# Altium schematic sheet [002] Battery.SchDoc
size A4
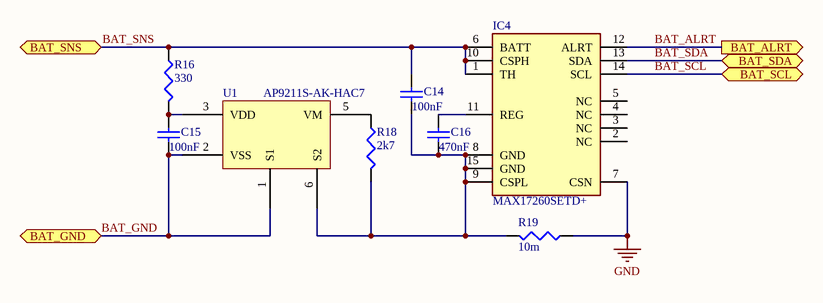
[diagram p0: [002] Battery.SchDoc]

## Parts
C14  value 100nF  [1608[0603]]  (hidden comment: Cap Semi)
C15  value 100nF  [1608[0603]]  (hidden comment: Cap Semi)
C16  value 470nF  [1608[0603]]  (hidden comment: Cap Semi)
IC4  MAX17260SETD+  [SON40P300X300X80-15N]
R16  value 330  [J1-0603]  (hidden comment: Res3)
R18  value 2k7  [J1-0603]  (hidden comment: Res3)
R19  value 10m  [RESC3216X80N]  (hidden comment: Res3)
U1  AP9211S-AK-HAC7  [U-DFN2030-6]

## Ports
BAT_ALRT (out), BAT_GND (bidir), BAT_SCL (bidir), BAT_SDA (bidir), BAT_SNS (bidir)

## Nets
GND: IC4.7(CSN) R19.1
BAT_ALRT: IC4.12(ALRT) ; port BAT_ALRT
BAT_GND: C15.1 U1.1(S1) U1.2(VSS) ; port BAT_GND
BAT_SCL: IC4.14(SCL) ; port BAT_SCL
BAT_SDA: IC4.13(SDA) ; port BAT_SDA
BAT_SNS: C14.2 IC4.1(TH) IC4.6(BATT) IC4.10(CSPH) R16.1 ; port BAT_SNS
NetC14_1: C14.1 C16.1 IC4.8(GND) IC4.9(CSPL) IC4.15(GND) R18.2 R19.2 U1.6(S2)
NetC15_2: C15.2 R16.2 U1.3(VDD)
NetC16_2: C16.2 IC4.11(REG)
NetR18_1: R18.1 U1.5(VM)

Not connected (* = marked no-connect by the designer): IC4 2(NC) 3(NC) 4(NC) 5(NC)

## Library data of the parts
C14-C16 = Cap Semi: Capacitor (Semiconductor SIM Model); Published: 8-Jun-2000; LatestRevisionDate: 29-May-2009; LatestRevisionNote: IPC-7351 Footprint Added.; PackageReference: C1206; Publisher: Altium Limited; PackageDescription: Chip Capacitor
IC4 = MAX17260SETD+: Integrated Circuit; Manufacturer_Name: Maxim Integrated; Datasheet Link: https://componentsearchengine.com/Datasheets/1/MAX17260SETD+.pdf; Height: 0.8mm; Mouser2 Part Number: 700-MAX17260SETD+; Mouser2 Price/Stock: https://www.mouser.com/Search/Refine.aspx?Keyword=700-MAX17260SETD%2B; Manufacturer_Part_Number: MAX17260SETD+; ComponentLink1Description: MAX17260 Datasheet; ComponentLink1URL: https://datasheets.maximintegrated.com/en/ds/MAX17260.pdf; ComponentLink2Description: MAX17260SETD+ (Mouser); ComponentLink2URL: https://pl.mouser.com/ProductDetail/Maxim-Integrated/MAX17260SETD%2b?qs=sGAEpiMZZMve4%2FbfQkoj%252BAnnYqGcWj2a8PZHpMVmFSA%3D; ComponentLink3Description: MAX17260 User Guide; ComponentLink3URL: https://pdfserv.maximintegrated.com/en/an/MAX1726x-ModelGauge-m5-EZ-user-guide.pdf
R16 R18 R19 = Res3: Resistor; Published: 8-Jun-2000; LatestRevisionDate: 29-May-2009; LatestRevisionNote: IPC-7351 Footprint Added.; PackageReference: J1-0603; Publisher: Altium Limited; PackageDescription: Chip Resistor
U1 = AP9211: SINGLE CHIP SOLUTION FOR 1-CELL Li+ BATTERY PACK; ComponentLink1Description: AP9211S-AK-HAC-7 (Mouser); ComponentLink1URL: https://pl.mouser.com/ProductDetail/Diodes-Incorporated/AP9211S-AK-HAC-7?qs=%2Fha2pyFaduhU8ORG8s%252BdQ8ce%2FFXbiZtTJujjlGEM9Y4G1qKWx8axSg%3D%3D; ComponentLink2Description: AP9211 Datasheet; ComponentLink2URL: https://www.diodes.com/assets/Datasheets/AP9211.pdf